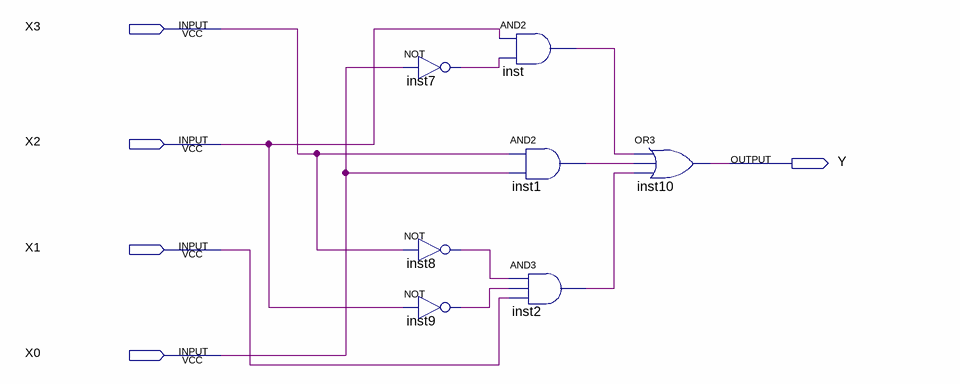
[diagram p0: schematic sheet]
// Quartus schematic lab_3.bdf as structural Verilog: 7 symbols, 5 pins
module lab_3 (
  input  X3,
  input  X2,
  input  X1,
  input  X0,
  output Y
);

  wire inst1_out, inst2_out, inst7_out, inst8_out, inst9_out, inst_out;

  not inst7 (inst7_out, X0);
  not inst8 (inst8_out, X3);
  not inst9 (inst9_out, X2);
  and inst (inst_out, X2, inst7_out);
  and inst1 (inst1_out, X3, X0);
  and inst2 (inst2_out, inst8_out, inst9_out, X1);
  or inst10 (Y, inst_out, inst1_out, inst2_out);
endmodule
